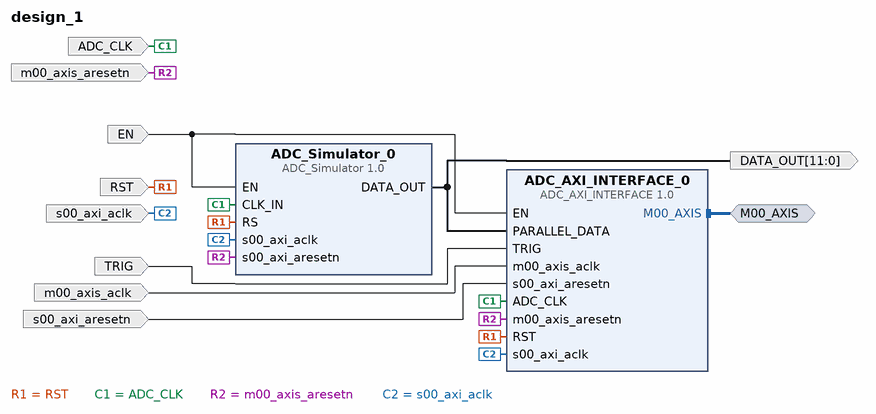
[diagram p0: block diagram of the top level]
# Vivado block design design_1, xc7z010clg400-1, Vivado 2017.2
create_bd_design design_1

create_bd_intf_port -mode Master -vlnv xilinx.com:interface:axis_rtl:1.0 M00_AXIS
create_bd_port -dir I TRIG
create_bd_port -dir I EN
create_bd_port -dir I -type rst RST
create_bd_port -dir I -type clk ADC_CLK
set_property -dict {CONFIG.FREQ_HZ 100000000} [get_bd_ports ADC_CLK]
create_bd_port -dir I -type clk m00_axis_aclk
set_property -dict {CONFIG.FREQ_HZ 100000000} [get_bd_ports m00_axis_aclk]
create_bd_port -dir I -type rst m00_axis_aresetn
create_bd_port -dir I -type clk s00_axi_aclk
set_property -dict {CONFIG.FREQ_HZ 100000000} [get_bd_ports s00_axi_aclk]
create_bd_port -dir I -type rst s00_axi_aresetn
create_bd_port -dir O -from 11 -to 0 DATA_OUT

create_bd_cell -type ip -vlnv xilinx.com:user:ADC_AXI_INTERFACE:1.0 ADC_AXI_INTERFACE_0
set_property -dict {CONFIG.PARALLEL_INPUT_DATA_WIDTH 12} [get_bd_cells ADC_AXI_INTERFACE_0]
create_bd_cell -type ip -vlnv xilinx.com:user:ADC_Simulator:1.0 ADC_Simulator_0

# ---- connections ----

connect_bd_intf_net [get_bd_intf_ports M00_AXIS] [get_bd_intf_pins ADC_AXI_INTERFACE_0/M00_AXIS]
connect_bd_net [get_bd_ports TRIG] [get_bd_pins ADC_AXI_INTERFACE_0/TRIG]
connect_bd_net [get_bd_ports EN] [get_bd_pins ADC_AXI_INTERFACE_0/EN] [get_bd_pins ADC_Simulator_0/EN]
connect_bd_net [get_bd_ports RST] [get_bd_pins ADC_AXI_INTERFACE_0/RST] [get_bd_pins ADC_Simulator_0/RS]
connect_bd_net [get_bd_ports ADC_CLK] [get_bd_pins ADC_AXI_INTERFACE_0/ADC_CLK] [get_bd_pins ADC_Simulator_0/CLK_IN]
connect_bd_net [get_bd_ports m00_axis_aclk] [get_bd_pins ADC_AXI_INTERFACE_0/m00_axis_aclk]
connect_bd_net [get_bd_ports m00_axis_aresetn] [get_bd_pins ADC_AXI_INTERFACE_0/m00_axis_aresetn] [get_bd_pins ADC_Simulator_0/s00_axi_aresetn]
connect_bd_net [get_bd_ports s00_axi_aclk] [get_bd_pins ADC_AXI_INTERFACE_0/s00_axi_aclk] [get_bd_pins ADC_Simulator_0/s00_axi_aclk]
connect_bd_net [get_bd_ports s00_axi_aresetn] [get_bd_pins ADC_AXI_INTERFACE_0/s00_axi_aresetn]
connect_bd_net [get_bd_pins ADC_Simulator_0/DATA_OUT] [get_bd_ports DATA_OUT] [get_bd_pins ADC_AXI_INTERFACE_0/PARALLEL_DATA]

validate_bd_design
save_bd_design
